# Altium schematic sheet Sheet1.SchDoc
size A4; SheetNumber: 1; SheetTotal: 1; SPICEModelCacheTHGTMUFU: <root> / <DocumentId>THGTMUFU</DocumentId> / <CacheFrame Number="0"> / <Model Name="2n3904" Kind="MDL"> / <Text>*2N3904 / *Si 310mW  40V 200mA 300MHz pkg:TO-92B 1,2,3 / .MODEL 2N3904 NPN(IS=1.4E-14 BF=300 VAF=100 IKF=0.025 ISE=3E-13 / + BR=7.5 RC=2.4 CJE=4.5E-12 TF=4E-10 CJC=3.5E-12 TR=2.1E-8 XTB=1.5 KF=9E-16 )</Text> / </Model> / <Model Name="2n3906" Kind="MDL"> / <Text>*2N3906 / *Si 310mW  40V 200mA 250MHz pkg:TO-92B 1,2,3 / .MODEL 2N3906 PNP(IS=4E-14 BF=400 VAF=50 IKF=0.02 ISE=7E-15 NE=1.16 / + BR=7.5 RC=2.4 CJE=6.3E-12 VJE=0.75 TF=5E-10 CJC=5.8E-12 VJC=0.75 TR=2.3E-8 / + VJS=0.75 XTB=1.5 KF=6E-16 )</Text> / </Model> / </CacheFrame> / </root>
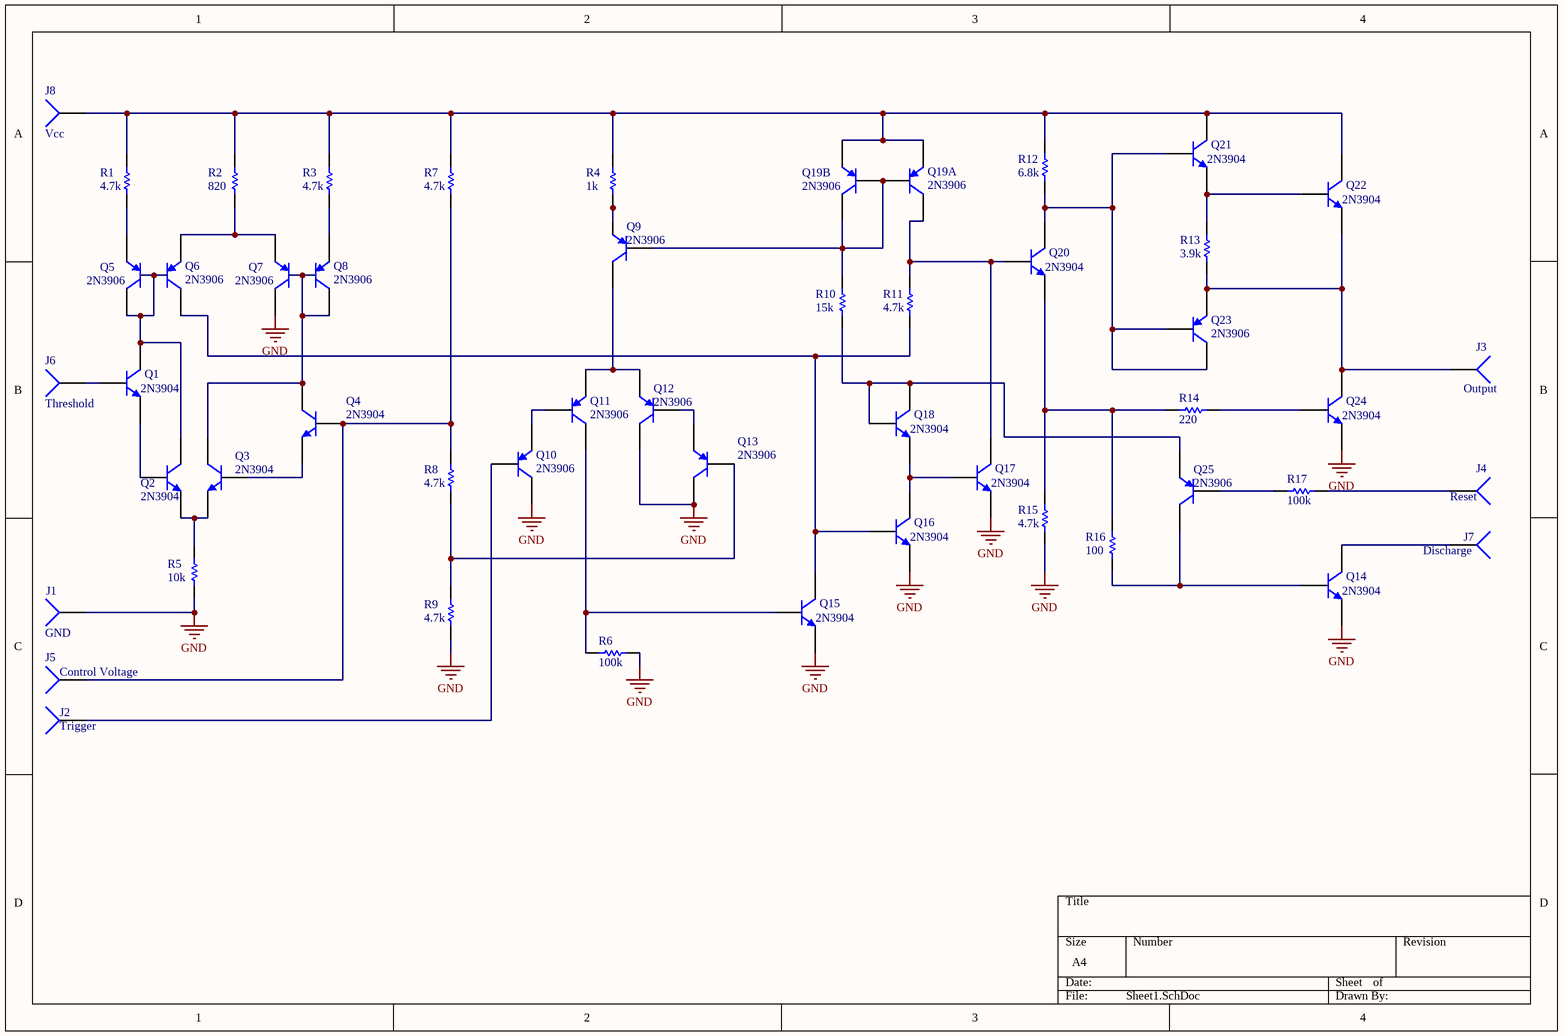
[diagram p0: Sheet1.SchDoc]

## Parts
J1  GND  [PIN1]
J2  Trigger  [PIN1]
J3  Output  [PIN1]
J4  Reset  [PIN1]
J5  Control Voltage  [PIN1]
J6  Threshold  [PIN1]
J7  Discharge  [PIN1]
J8  Vcc  [PIN1]
Q1  2N3904  [TO-92A]
Q2  2N3904  [TO-92A]
Q3  2N3904  [TO-92A]
Q4  2N3904  [TO-92A]
Q5  2N3906  [TO-92A]
Q6  2N3906  [TO-92A]
Q7  2N3906  [TO-92A]
Q8  2N3906  [TO-92A]
Q9  2N3906  [TO-92A]
Q10  2N3906  [TO-92A]
Q11  2N3906  [TO-92A]
Q12  2N3906  [TO-92A]
Q13  2N3906  [TO-92A]
Q14  2N3904  [TO-92A]
Q15  2N3904  [TO-92A]
Q16  2N3904  [TO-92A]
Q17  2N3904  [TO-92A]
Q18  2N3904  [TO-92A]
Q19A  2N3906  [TO-92A]
Q19B  2N3906  [TO-92A]
Q20  2N3904  [TO-92A]
Q21  2N3904  [TO-92A]
Q22  2N3904  [TO-92A]
Q23  2N3906  [TO-92A]
Q24  2N3904  [TO-92A]
Q25  2N3906  [TO-92A]
R1  value 4.7k  [AXIAL-0.3]  (hidden comment: Res1)
R2  value 820  [AXIAL-0.3]  (hidden comment: Res1)
R3  value 4.7k  [AXIAL-0.3]  (hidden comment: Res1)
R4  value 1k  [AXIAL-0.3]  (hidden comment: Res1)
R5  value 10k  [AXIAL-0.3]  (hidden comment: Res1)
R6  value 100k  [AXIAL-0.3]  (hidden comment: Res1)
R7  value 4.7k  [AXIAL-0.3]  (hidden comment: Res1)
R8  value 4.7k  [AXIAL-0.3]  (hidden comment: Res1)
R9  value 4.7k  [AXIAL-0.3]  (hidden comment: Res1)
R10  value 15k  [AXIAL-0.3]  (hidden comment: Res1)
R11  value 4.7k  [AXIAL-0.3]  (hidden comment: Res1)
R12  value 6.8k  [AXIAL-0.3]  (hidden comment: Res1)
R13  value 3.9k  [AXIAL-0.3]  (hidden comment: Res1)
R14  value 220  [AXIAL-0.3]  (hidden comment: Res1)
R15  value 4.7k  [AXIAL-0.3]  (hidden comment: Res1)
R16  value 100  [AXIAL-0.3]  (hidden comment: Res1)
R17  value 100k  [AXIAL-0.3]  (hidden comment: Res1)

## Nets
GND: J1.1 Q7.3(C) Q10.3(C) Q12.3(C) Q13.3(C) Q14.1(E) Q15.1(E) Q16.1(E) Q17.1(E) Q24.1(E) R5.1 R6.1 R9.1 R15.1
NetJ2_1: J2.1 Q10.2(B)
NetJ3_1: J3.1 Q22.1(E) Q23.1(E) Q24.3(C) R13.1
NetJ4_1: J4.1 R17.1
NetJ5_1: J5.1 Q4.2(B) R7.1 R8.2
NetJ6_1: J6.1 Q1.2(B)
NetJ7_1: J7.1 Q14.3(C)
NetJ8_1: J8.1 Q19A.1(E) Q19B.1(E) Q21.3(C) Q22.3(C) R1.2 R2.2 R3.2 R4.2 R7.2 R12.2
NetQ1_1: Q1.1(E) Q2.2(B)
NetQ1_3: Q1.3(C) Q2.3(C) Q5.2(B) Q5.3(C) Q6.2(B)
NetQ2_1: Q2.1(E) Q3.1(E) R5.2
NetQ3_2: Q3.2(B) Q4.1(E)
NetQ3_3: Q3.3(C) Q4.3(C) Q7.2(B) Q8.2(B) Q8.3(C)
NetQ5_1: Q5.1(E) R1.1
NetQ6_1: Q6.1(E) Q7.1(E) R2.1
NetQ6_3: Q6.3(C) Q15.3(C) Q16.2(B) R11.1
NetQ8_1: Q8.1(E) R3.1
NetQ9_1: Q9.1(E) R4.1
NetQ9_2: Q9.2(B) Q19A.2(B) Q19B.2(B) Q19B.3(C) R10.2
NetQ9_3: Q9.3(C) Q11.1(E) Q12.1(E)
NetQ10_1: Q10.1(E) Q11.2(B)
NetQ11_3: Q11.3(C) Q15.2(B) R6.2
NetQ12_2: Q12.2(B) Q13.1(E)
NetQ13_2: Q13.2(B) R8.1 R9.2
NetQ14_2: Q14.2(B) Q25.3(C) R16.1
NetQ16_3: Q16.3(C) Q17.2(B) Q18.1(E)
NetQ17_3: Q17.3(C) Q19A.3(C) Q20.2(B) R11.2
NetQ18_2: Q18.2(B) Q18.3(C) Q25.1(E) R10.1
NetQ20_1: Q20.1(E) R14.2 R15.2 R16.2
NetQ20_3: Q20.3(C) Q21.2(B) Q23.2(B) Q23.3(C) R12.1
NetQ21_1: Q21.1(E) Q22.2(B) R13.2
NetQ24_2: Q24.2(B) R14.1
NetQ25_2: Q25.2(B) R17.2

## Library data of the parts
J1-J8 = Socket: LatestRevisionDate: 17-Jul-2002; LatestRevisionNote: Re-released for DXP Platform.; Publisher: Altium Limited
Q1-Q4 Q14-Q18 Q20-Q22 Q24 = 2N3904: NPN General Purpose Amplifier; Published: 8-Jun-2000; LatestRevisionDate: 15-Jan-2003; LatestRevisionNote: PCB Footprint 'BCY-W3/D4.7' replaced; DatasheetVersion: 1997; PackageVersion: Sep-1998; PackageReference: TO-92A; Publisher: Altium Limited; PackageDescription: TO, Flat Index; 3 In-Line, Axial Leads; Body Dia. 4.5mm; Leads 0.51 x 0.48 mm (max); ComponentLink1Description: Manufacturer Link; ComponentLink1URL: http://www.fairchildsemi.com/; ComponentLink2Description: Datasheet; ComponentLink2URL: http://www.fairchildsemi.com/ds/2N%2F2N3904.pdf
Q5-Q13 Q19A Q19B Q23 Q25 = 2N3906: PNP General Purpose Amplifier; Published: 8-Jun-2000; LatestRevisionDate: 15-Jan-2003; LatestRevisionNote: PCB Footprint 'BCY-W3/D4.7' replaced; DatasheetVersion: 1997; PackageVersion: Sep-1998; PackageReference: TO-92A; Publisher: Altium Limited; PackageDescription: TO, Flat Index; 3 In-Line, Axial Leads; Body Dia. 4.5mm; Leads 0.51 x 0.48 mm (max); ComponentLink1Description: Manufacturer Link; ComponentLink1URL: http://www.fairchildsemi.com/; ComponentLink2Description: Datasheet; ComponentLink2URL: http://www.fairchildsemi.com/ds/2N%2F2N3906.pdf
R1-R17 = Res1: Resistor; Published: 8-Jun-2000; LatestRevisionDate: 17-Jul-2002; LatestRevisionNote: Re-released for DXP Platform.; PackageReference: AXIAL-0.3; Publisher: Altium Limited; PackageDescription: Axial Device, Thru-Hole; 2 Leads; 0.3 in Pin Spacing